# Altium schematic sheet switch.SchDoc
size A4; SheetNumber: 2; SheetTotal: 8
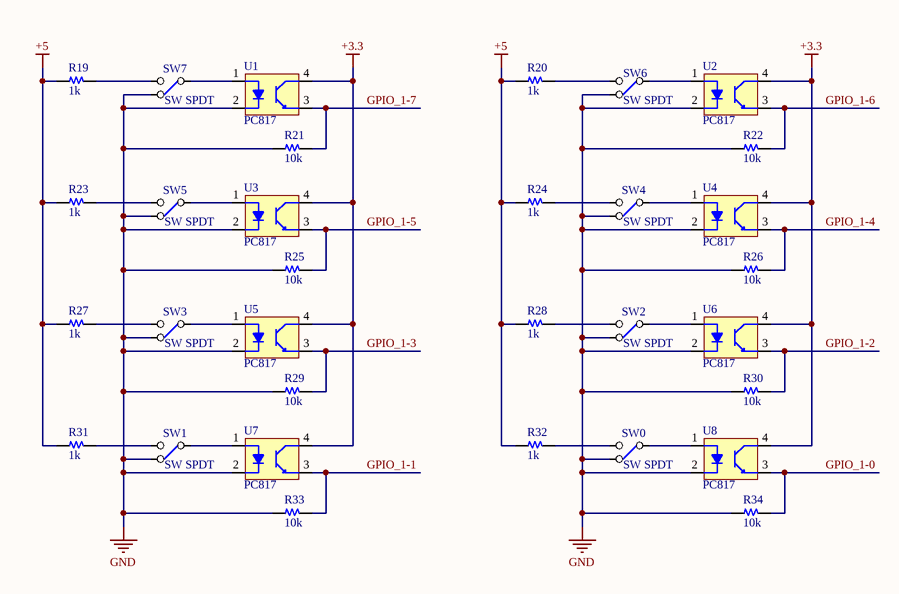
[diagram p0: switch.SchDoc]

## Parts
R19  1k  [R 0603]
R20  1k  [R 0603]
R21  10k  [R 0603]
R22  10k  [R 0603]
R23  1k  [R 0603]
R24  1k  [R 0603]
R25  10k  [R 0603]
R26  10k  [R 0603]
R27  1k  [R 0603]
R28  1k  [R 0603]
R29  10k  [R 0603]
R30  10k  [R 0603]
R31  1k  [R 0603]
R32  1k  [R 0603]
R33  10k  [R 0603]
R34  10k  [R 0603]
SW0  SW SPDT  [SW/3/SPDT/SS12D10]
SW1  SW SPDT  [SW/3/SPDT/SS12D10]
SW2  SW SPDT  [SW/3/SPDT/SS12D10]
SW3  SW SPDT  [SW/3/SPDT/SS12D10]
SW4  SW SPDT  [SW/3/SPDT/SS12D10]
SW5  SW SPDT  [SW/3/SPDT/SS12D10]
SW6  SW SPDT  [SW/3/SPDT/SS12D10]
SW7  SW SPDT  [SW/3/SPDT/SS12D10]
U1  PC817  [SOP4 - PC817]
U2  PC817  [SOP4 - PC817]
U3  PC817  [SOP4 - PC817]
U4  PC817  [SOP4 - PC817]
U5  PC817  [SOP4 - PC817]
U6  PC817  [SOP4 - PC817]
U7  PC817  [SOP4 - PC817]
U8  PC817  [SOP4 - PC817]

## Nets
+3.3: U1.4(C) U2.4(C) U3.4(C) U4.4(C) U5.4(C) U6.4(C) U7.4(C) U8.4(C)
+5: R19.1 R20.1 R23.1 R24.1 R27.1 R28.1 R31.1 R32.1
GND: R21.1 R22.1 R25.1 R26.1 R29.1 R30.1 R33.1 R34.1 SW0.1(NC1) SW1.1(NC1) SW2.1(NC1) SW3.1(NC1) SW4.1(NC1) SW5.1(NC1) SW6.1(NC1) SW7.1(NC1) U1.2(K) U2.2(K) U3.2(K) U4.2(K) U5.2(K) U6.2(K) U7.2(K) U8.2(K)
GPIO_1-0: R34.2 U8.3(E)
GPIO_1-1: R33.2 U7.3(E)
GPIO_1-2: R30.2 U6.3(E)
GPIO_1-3: R29.2 U5.3(E)
GPIO_1-4: R26.2 U4.3(E)
GPIO_1-5: R25.2 U3.3(E)
GPIO_1-6: R22.2 U2.3(E)
GPIO_1-7: R21.2 U1.3(E)
NetR19_2: R19.2 SW7.3(NO1)
NetR20_2: R20.2 SW6.3(NO1)
NetR23_2: R23.2 SW5.3(NO1)
NetR24_2: R24.2 SW4.3(NO1)
NetR27_2: R27.2 SW3.3(NO1)
NetR28_2: R28.2 SW2.3(NO1)
NetR31_2: R31.2 SW1.3(NO1)
NetR32_2: R32.2 SW0.3(NO1)
NetSW0_2: SW0.2(COMMON1) U8.1(A)
NetSW1_2: SW1.2(COMMON1) U7.1(A)
NetSW2_2: SW2.2(COMMON1) U6.1(A)
NetSW3_2: SW3.2(COMMON1) U5.1(A)
NetSW4_2: SW4.2(COMMON1) U4.1(A)
NetSW5_2: SW5.2(COMMON1) U3.1(A)
NetSW6_2: SW6.2(COMMON1) U2.1(A)
NetSW7_2: SW7.2(COMMON1) U1.1(A)

## Library data of the parts
R19-R34 = Resistor
U1-U8 = PC817: Opto PC817B